# Altium schematic sheet connector_b.SchDoc
size A3; SheetNumber: 15; SheetTotal: 15
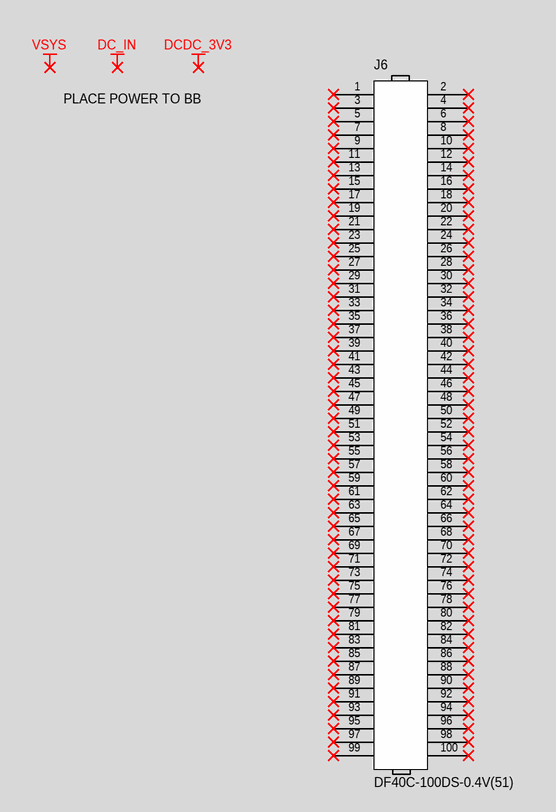
[diagram p0: connector_b.SchDoc]

## Parts
J6  DF40C-100DS-0.4V(51)  [CONN_B2B_HIROSE_DF40C-100DS-0.4V(51)]

## Nets

Not connected (* = marked no-connect by the designer): J6 1* 2* 3* 4* 5* 6* 7* 8* 9* 10* 11* 12* 13* 14* 15* 16* 17* 18* 19* 20* 21* 22* 23* 24* 25* 26* 27* 28* 29* 30* 31* 32* 33* 34* 35* 36* 37* 38* 39* 40* 41* 42* 43* 44* 45* 46* 47* 48* 49* 50* 51* 52* 53* 54* 55* 56* 57* 58* 59* 60* 61* 62* 63* 64* 65* 66* 67* 68* 69* 70* 71* 72* 73* 74* 75* 76* 77* 78* 79* 80* 81* 82* 83* 84* 85* 86* 87* 88* 89* 90* 91* 92* 93* 94* 95* 96* 97* 98* 99* 100*

## Notes on the sheet
- PLACE POWER TO BB
- Labels drawn without touching a wire or pin: DC_IN, DCDC_3V3, VSYS
- PCB Des :
- Approv By :
- Project Title :
- Sheet Title :
- Date :
- PCB Version :
- Size :
- A3
- Page :
- PCB Revision :

## Library data of the parts
J6 = CONN_B2B_100P_RE_DF40C-100DS-0.4V(51): Board-to-Board Connector with 0.4-mm Pitch, 1.5 - 4.0-mm Height - DF40 Series (HIROSE ELECTRIC); Voltage Rating: 30V; Current Rating: 300mA; Connector Type: Receptacle; Number of Positions: 100; Contact Resistance: 90mR; Pitch: 0.4mm; Mated Stacking Heights: 1.5mm; Contact Pitch: 400um; Supplier 1: Digikey; Manufacturer: Hirose; Manufacturer Part Number: DF40C-100DS-0.4V(51); RoHS: Yes; Category: Headers and Wire Housings; Stock 1: 4275; Pricing 1: 1=1.91, 10=1.661, 25=1.5908, 50=1.5554, 100=1.4847, 250=1.34328, 500=1.23724, 1000=1.0605, 2500=0.9898 (USD); Mount: Surface Mount; Contact Material: Bronze; Contact Plating: Gold; Housing Material: Polymer; Housing Color: Black; Min Operating Temperature: -35°C; Max Operating Temperature: 85°C; Number of Rows: 2; Packaging: Tape and Reel; Package Quantity: 1; Termination: SMD/SMT; Number of Contacts: 100; Orientation: Straight; Series: DF40; Max Current Rating: 300mA; Max Voltage Rating (AC): 30V; Gender: Receptacle; Contact Voltage Rating (AC): 30V; Contact Voltage Rating (DC): 30V; Length: 22.6mm; Depth: 3.38mm; Radiation Hardening: No; Reach SVHC Compliant: No; Lead Free: Lead Free; RoHS Compliant: Yes; ComponentLink1URL: https://datasheet.ciiva.com/26948/getdatasheetpartid-441624-26948933.pdf?src-supplier=Verical; ComponentLink1Description: https://datasheet.ciiva.com/26948/getdatasheetpartid-441624-26948933.pdf?src-supplier=Verical; ComponentLink2URL: https://datasheet.ciiva.com/46408/1824826-46408894.pdf?src-supplier=Element14; ComponentLink2Description: https://datasheet.ciiva.com/46408/1824826-46408894.pdf?src-supplier=Element14; Supplier Part Number 1: H11615CT-ND